# Altium schematic sheet Supply.SchDoc
size A4; SheetNumber: 2; SheetTotal: 10
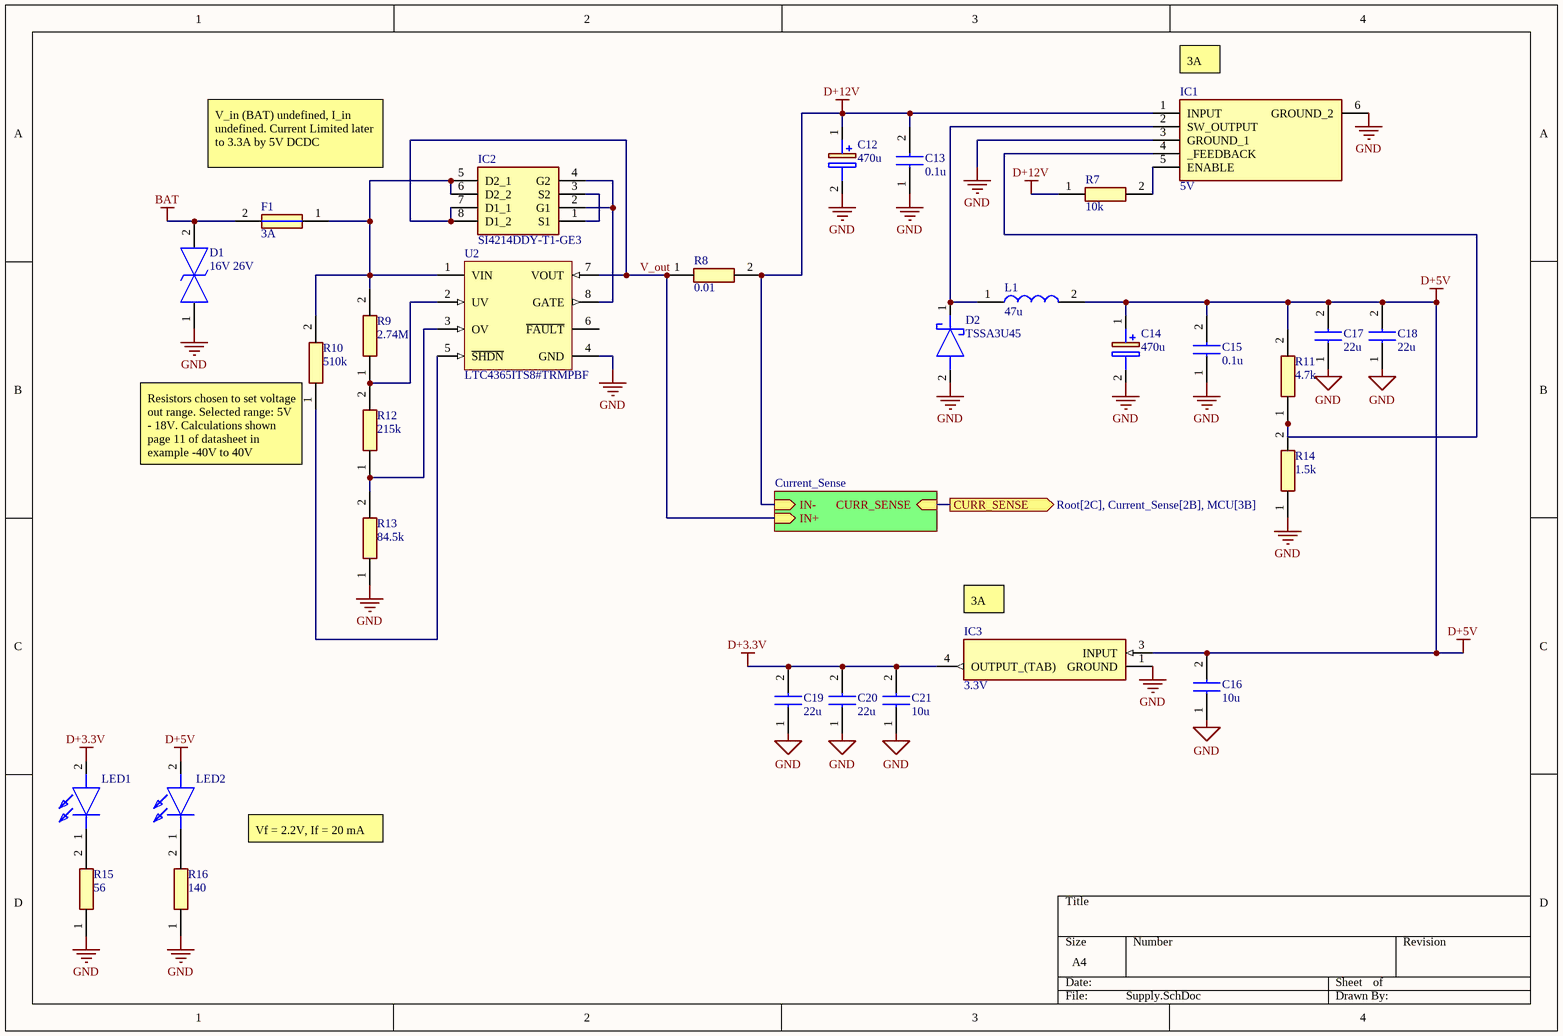
[diagram p0: Supply.SchDoc]

## Parts
C12  470u  [CAPAE1030X1080N]
C13  0.1u  [CAPC1608X90N]
C14  470u  [CAPAE1030X1080N]
C15  0.1u  [CAPC1608X90N]
C16  10u  [GRM18x]
C17  22u  [CAPC2012X95N]
C18  22u  [CAPC2012X95N]
C19  22u  [CAPC2012X95N]
C20  22u  [CAPC2012X95N]
C21  10u  [GRM18x]
D1  16V 26V  [DIONM5226X240N]
D2  TSSA3U45  [DIOM5126X250N]
F1  3A  [FUSC3216X83N]
IC1  5V  [TS2596CM550RNG]
IC2  SI4214DDY-T1-GE3  [SOIC127P600X175-8N]
IC3  3.3V  [TO254P1542X460-3N]
L1  47u  [104CDMCCDS470MC]
LED1  SML-D12P8WT86C  [LEDM1620X150N]  (value not drawn)
LED2  SML-D12P8WT86C  [LEDM1620X150N]  (value not drawn)
R7  10k  [RESC1608X55N]
R8  0.01  [CSS0603FT10L0]
R9  2.74M  [RESC1608X50N]
R10  510k  [RESC1608X55N]
R11  4.7k  [RESC1608X55N]
R12  215k  [RESC1608X55N]
R13  84.5k  [RESC1608X55N]
R14  1.5k  [RESC1608X55N]
R15  56  [RESC2012X60N]
R16  140  [RESC2012X60N]
U2  LTC4365ITS8#TRMPBF  [LT-TS8-8-TSOT-23_V]

## Sub-sheets
Designator = Current_Sense: IN+ (in), IN- (in), CURR_SENSE (in)

## Ports
CURR_SENSE (out, see Root[2C], Current_Sense[2B], MCU[3B])

## Nets
BAT: D1.2 F1.2
D+3.3V: C19.2 C20.2 C21.2 IC3.4(OUTPUT_(TAB)) LED1.2(A)
D+5V: C14.1(+) C15.2 C16.2 C17.2 C18.2 IC3.3(INPUT) L1.2 LED2.2(A) R11.2
D+12V: C12.1(+) C13.2 IC1.1(INPUT) R7.1 R8.2 ; sheet Designator/IN-
GND: C12.2(-) C13.1 C14.2(-) C15.1 C16.1 C17.1 C18.1 C19.1 C20.1 C21.1 D1.1 D2.2(A) IC1.3(GROUND_1) IC1.6(GROUND_2) IC3.1(GROUND) R13.1 R14.1 R15.1 R16.1 U2.4(GND)
CURR_SENSE: port CURR_SENSE, sheet Designator/CURR_SENSE
V_out: IC2.7(D1_1) IC2.8(D1_2) R8.1 U2.7(VOUT) ; sheet Designator/IN+
NetD2_1: D2.1(K) IC1.2(SW_OUTPUT) L1.1
NetF1_1: F1.1 IC2.5(D2_1) IC2.6(D2_2) R9.2 R10.2 U2.1(VIN)
NetIC1_4: IC1.4(_FEEDBACK) R11.1 R14.2
NetIC1_5: IC1.5(ENABLE) R7.2
NetIC2_1: IC2.1(S1) IC2.3(S2)
NetIC2_2: IC2.2(G1) IC2.4(G2) U2.8(GATE)
NetLED1_1: LED1.1(K) R15.2
NetLED2_1: LED2.1(K) R16.2
NetR9_1: R9.1 R12.2 U2.2(UV)
NetR10_1: R10.1 U2.5(~{SHDN})
NetR12_1: R12.1 R13.2 U2.3(OV)

Not connected (* = marked no-connect by the designer): U2 6(~{FAULT})

## Notes on the sheet
- (near IC1) 3A
- V_in (BAT) undefined, I_in undefined. Current Limited later to 3.3A by 5V DCDC
- (near R10) Resistors chosen to set voltage out range. Selected range: 5V - 18V. Calculations shown page 11 of datasheet in example -40V to 40V
- (near IC3) 3A
- Vf = 2.2V, If = 20 mA

## Library data of the parts
C12 C14 = UWT1E471MNL1GS: Manufacturer_Name: Nichicon; Datasheet Link: http://www.nichicon.co.jp/english/products/pdfs/e-uwt.pdf; Height: 10.8mm; Manufacturer_Part_Number: UWT1E471MNL1GS; Mouser Part Number: 647-UWT1E471MNL1S; Mouser Price/Stock: https://www.mouser.co.uk/ProductDetail/Nichicon/UWT1E471MNL1GS?qs=58AOoXU9eaxhCCrDm%2FRamg%3D%3D; Arrow Part Number: UWT1E471MNL1GS; Arrow Price/Stock: https://www.arrow.com/en/products/uwt1e471mnl1gs/nichicon?region=nac
C13 C15 = CC0603KRX7R8BB104: Manufacturer_Name: KEMET; Datasheet Link: https://datasheet.datasheetarchive.com/originals/distributors/Datasheets_SAMA/d9f127a4875522309d99aa7dec79633c.pdf; Height: 0.9mm; Manufacturer_Part_Number: CC0603KRX7R8BB104; Mouser Part Number: 603-CC603KRX7R8BB104; Mouser Price/Stock: https://www.mouser.co.uk/ProductDetail/Yageo/CC0603KRX7R8BB104?qs=AgBp2OyFlx%252B4QOgEm%2Fb3YQ%3D%3D; Arrow Part Number: CC0603KRX7R8BB104; Arrow Price/Stock: https://www.arrow.com/en/products/cc0603krx7r8bb104/yageo
C16 C21 = GRM188R61A106ME69D: Manufacturer_Name: Murata Electronics; Datasheet Link: https://search.murata.co.jp/Ceramy/image/img/A01X/G101/ENG/GRM188R61A106ME69-01A.pdf; Height: 0.8mm; Manufacturer_Part_Number: GRM188R61A106ME69D; Mouser Part Number: 81-GRM188R61A106ME9D; Mouser Price/Stock: https://www.mouser.co.uk/ProductDetail/Murata-Electronics/GRM188R61A106ME69D?qs=o98hbGm2QKGN31NsNZp5HQ%3D%3D; Arrow Part Number: GRM188R61A106ME69D; Arrow Price/Stock: https://www.arrow.com/en/products/grm188r61a106me69d/murata-manufacturing?region=nac
C17-C20 = GRM219R61A226MEA0D: Manufacturer_Name: Murata Electronics; Datasheet Link: http://www.murata.com/~/media/webrenewal/support/library/catalog/products/capacitor/mlcc/c02e.pdf; Height: 0.95mm; Manufacturer_Part_Number: GRM219R61A226MEA0D; Mouser Part Number: 81-GRM219R61A226ME0D; Mouser Price/Stock: https://www.mouser.co.uk/ProductDetail/Murata-Electronics/GRM219R61A226MEA0D?qs=eeBpzGFlv%252B9ilUnm7iaG2w%3D%3D; Arrow Part Number: GRM219R61A226MEA0D; Arrow Price/Stock: https://www.arrow.com/en/products/grm219r61a226mea0d/murata-manufacturing?region=nac
D1 = SMAJ16CA-13-F: Manufacturer_Name: Diodes Incorporated; Datasheet Link: https://www.diodes.com/assets/Datasheets/ds19005.pdf; Height: 2.4mm; Manufacturer_Part_Number: SMAJ16CA-13-F; Mouser Part Number: 621-SMAJ16CA-13-F; Mouser Price/Stock: https://www.mouser.co.uk/ProductDetail/Diodes-Incorporated/SMAJ16CA-13-F?qs=sxN%252BoM2fis%252Bu4iX3J5Cr7g%3D%3D; Arrow Part Number: SMAJ16CA-13-F; Arrow Price/Stock: https://www.arrow.com/en/products/smaj16ca-13-f/diodes-incorporated?region=nac
D2 = TSSA3U45: Schottky Diode; Manufacturer_Name: Taiwan Semiconductor; Height: 2.5mm; Manufacturer_Part_Number: TSSA3U45; Mouser Part Number: 821-TSSA3U45; Mouser Price/Stock: https://www.mouser.co.uk/ProductDetail/Taiwan-Semiconductor/TSSA3U45?qs=9cRNMfhK%252BrST5ZgV9DORjA%3D%3D
F1 = 0685T3000-01: Manufacturer_Name: BelFuse; Datasheet Link: https://www.belfuse.com/resources/datasheets/circuitprotection/ds-cp-c1t-series.pdf; Height: 0.83mm; Manufacturer_Part_Number: 0685T3000-01; Arrow Part Number: 0685T3000-01; Arrow Price/Stock: https://www.arrow.com/en/products/0685t3000-01/bel-group
IC1 = TS2596CM550_RNG: Manufacturer_Name: Taiwan Semiconductor; Manufacturer_Part_Number: TS2596CM550 RNG; Datasheet Link: https://www.taiwansemi.com/products/datasheet/TS2596_G1608.pdf; Height: 4.85mm; Mouser Part Number: 821-TS2596CM550RNG; Mouser Price/Stock: https://www.mouser.co.uk/ProductDetail/Taiwan-Semiconductor/TS2596CM550-RNG?qs=QEzMiVqgwc1IpOivVc2Ydw%3D%3D; Arrow Part Number: TS2596CM550 RNG; Arrow Price/Stock: https://www.arrow.com/en/products/ts2596cm550rng/taiwan-semiconductor?region=europe
IC2 = SI4214DDY-T1-GE3: Integrated Circuit; Manufacturer_Name: Vishay; Datasheet Link: https://www.vishay.com/docs/65022/si4214ddy.pdf; Height: 1.75mm; Manufacturer_Part_Number: SI4214DDY-T1-GE3; Mouser Part Number: 781-SI4214DDY-GE3; Mouser Price/Stock: https://www.mouser.co.uk/ProductDetail/Vishay-Semiconductors/SI4214DDY-T1-GE3?qs=kt16UJ73eEGZKWuc2RKrng%3D%3D; Arrow Part Number: SI4214DDY-T1-GE3; Arrow Price/Stock: https://www.arrow.com/en/products/si4214ddy-t1-ge3/vishay
IC3 = LD1085D2M33R: Manufacturer_Name: STMicroelectronics; Datasheet Link: http://www.st.com/web/en/resource/technical/document/datasheet/CD00001883.pdf; Height: 4.6mm; Manufacturer_Part_Number: LD1085D2M33R; Mouser Part Number: 511-LD1085D2M33-TR; Mouser Price/Stock: https://www.mouser.co.uk/ProductDetail/STMicroelectronics/LD1085D2M33R?qs=LWigd6wg%252B9coO4fwnjoeQg%3D%3D; Arrow Part Number: LD1085D2M33R; Arrow Price/Stock: https://www.arrow.com/en/products/ld1085d2m33r/stmicroelectronics?region=nac
L1 = 104CDMCCDS-470MC: Manufacturer_Name: Sumida; Datasheet Link: https://products.sumida.com/products/pdf/104CDMCCDS.pdf; Height: 4mm; Manufacturer_Part_Number: 104CDMCCDS-470MC; Mouser Part Number: 851-104CDMCCDS-470MC; Mouser Price/Stock: https://www.mouser.co.uk/ProductDetail/Sumida/104CDMCCDS-470MC?qs=D3efs7kfDkXJMDQiS36zsw%3D%3D; Arrow Part Number: 104CDMCCDS-470MC; Arrow Price/Stock: https://www.arrow.com/en/products/104cdmccds-470mc/sumida?region=nac
LED1 LED2 = SML-D12P8WT86C: LED; Manufacturer_Name: ROHM Semiconductor; Datasheet Link: https://datasheet.datasheetarchive.com/originals/distributors/DKDS-39/8731.pdf; Height: 1.5mm; Manufacturer_Part_Number: SML-D12P8WT86C; Mouser Part Number: 755-SML-D12P8WT86C; Mouser Price/Stock: https://www.mouser.co.uk/ProductDetail/ROHM-Semiconductor/SML-D12P8WT86C?qs=HXFqYaX1Q2wFepzn1zWRrg%3D%3D
R7 = RC0603FR0710KL: Manufacturer_Name: KEMET; Datasheet Link: http://www.yageo.com/documents/recent/PYu-RC0603_51_RoHS_L_v5.pdf; Height: 0.55mm; Manufacturer_Part_Number: RC0603FR0710KL; Arrow Part Number: RC0603FR0710KL; Arrow Price/Stock: https://www.arrow.com/en/products/rc0603fr-0710kl/yageo
R8 = CSS0603FT10L0: Manufacturer_Name: Stackpole Electronics; Datasheet Link: https://cs.seielect.com/catalog/SEI-CSS_CSSH.PDF; Height: 0.65mm; Manufacturer_Part_Number: CSS0603FT10L0; Mouser Part Number: 708-CSS0603FT10L0; Mouser Price/Stock: https://www.mouser.co.uk/ProductDetail/SEI-Stackpole/CSS0603FT10L0?qs=IPgv5n7u5QYzRPLHp2eb2A%3D%3D
R9 = CRCW06032M74FKEA: Manufacturer_Name: Vishay; Datasheet Link: http://www.vishay.com/docs/20035/dcrcwe3.pdf; Height: 0.5mm; Manufacturer_Part_Number: CRCW06032M74FKEA; Mouser Part Number: 71-CRCW0603-2.74M-E3; Mouser Price/Stock: https://www.mouser.co.uk/ProductDetail/Vishay-Dale/CRCW06032M74FKEA?qs=m78yHlr47QCVMroNQkprhA%3D%3D
R10 = RC0603JR-07510KL: Manufacturer_Name: YAGEO; Datasheet Link: https://www.yageo.com/upload/media/product/productsearch/datasheet/rchip/PYu-RC_Group_51_RoHS_L_12.pdf; Height: 0.55mm; Manufacturer_Part_Number: RC0603JR-07510KL; Mouser Part Number: 603-RC0603JR-07510KL; Mouser Price/Stock: https://www.mouser.co.uk/ProductDetail/YAGEO/RC0603JR-07510KL?qs=KptU%252BSbrlu3yTjO7DJSdzQ%3D%3D; Arrow Part Number: RC0603JR-07510KL; Arrow Price/Stock: https://www.arrow.com/en/products/rc0603jr-07510kl/yageo?region=nac
R11 = RC0603FR-074K7L: Manufacturer_Name: YAGEO; Datasheet Link: https://componentsearchengine.com/Datasheets/2/RC0603FR-074K7L.pdf; Height: 0.55mm; Manufacturer_Part_Number: RC0603FR-074K7L; Mouser Part Number: 603-RC0603FR-074K7L; Mouser Price/Stock: https://www.mouser.co.uk/ProductDetail/YAGEO/RC0603FR-074K7L?qs=gt6vzsuosg37y0l7Vt36bQ%3D%3D; Arrow Part Number: RC0603FR-074K7L; Arrow Price/Stock: https://www.arrow.com/en/products/rc0603fr-074k7l/yageo?region=nac
R12 = ERJ-3EKF2153V: Manufacturer_Name: Panasonic; Datasheet Link: http://industrial.panasonic.com/cdbs/www-data/pdf/RDA0000/AOA0000C86.pdf; Height: 0.55mm; Manufacturer_Part_Number: ERJ-3EKF2153V; Mouser Part Number: 667-ERJ-3EKF2153V; Mouser Price/Stock: https://www.mouser.com/Search/Refine.aspx?Keyword=667-ERJ-3EKF2153V; Arrow Part Number: ERJ-3EKF2153V; Arrow Price/Stock: https://www.arrow.com/en/products/erj-3ekf2153v/panasonic
R13 = RC0603FR-0784K5L: Manufacturer_Name: KEMET; Datasheet Link: http://www.yageo.com/documents/recent/PYu-RC0603_51_RoHS_L_v5.pdf; Height: 0.55mm; Manufacturer_Part_Number: RC0603FR-0784K5L; Mouser Part Number: 603-RC0603FR-0784K5L; Mouser Price/Stock: https://www.mouser.com/Search/Refine.aspx?Keyword=603-RC0603FR-0784K5L; Arrow Part Number: RC0603FR-0784K5L; Arrow Price/Stock: https://www.arrow.com/en/products/rc0603fr-0784k5l/yageo
R14 = RC0603FR-071K5L: Manufacturer_Name: KEMET; Datasheet Link: http://www.yageo.com/documents/recent/PYu-RC0603_51_RoHS_L_v5.pdf; Height: 0.55mm; Manufacturer_Part_Number: RC0603FR-071K5L; Mouser Part Number: 603-RC0603FR-071K5L; Mouser Price/Stock: https://www.mouser.co.uk/ProductDetail/YAGEO/RC0603FR-071K5L?qs=VU8sRB4EgwBMt9nc4XGNgA%3D%3D; Arrow Part Number: RC0603FR-071K5L; Arrow Price/Stock: https://www.arrow.com/en/products/rc0603fr-071k5l/yageo?region=nac
R15 = RC0805FR-0756RL: Manufacturer_Name: KEMET; Datasheet Link: http://www.yageo.com/documents/recent/PYu-RC_Group_51_RoHS_L_10.pdf; Height: 0.6mm; Manufacturer_Part_Number: RC0805FR-0756RL; Mouser Part Number: 603-RC0805FR-0756RL; Mouser Price/Stock: https://www.mouser.co.uk/ProductDetail/YAGEO/RC0805FR-0756RL?qs=VLOqbHBAO5ckb16qgp9IuA%3D%3D; Arrow Part Number: RC0805FR-0756RL; Arrow Price/Stock: https://www.arrow.com/en/products/rc0805fr-0756rl/yageo?region=nac
R16 = RC0805FR-07140RL: Manufacturer_Name: KEMET; Datasheet Link: http://www.yageo.com/documents/recent/PYu-RC_Group_51_RoHS_L_10.pdf; Height: 0.6mm; Manufacturer_Part_Number: RC0805FR-07140RL; Mouser Part Number: 603-RC0805FR-07140RL; Mouser Price/Stock: https://www.mouser.co.uk/ProductDetail/YAGEO/RC0805FR-07140RL?qs=8Y8p%252BasKcI7sqDTj5iJQmA%3D%3D; Arrow Part Number: RC0805FR-07140RL; Arrow Price/Stock: https://www.arrow.com/en/products/rc0805fr-07140rl/yageo?region=nac
U2 = CMP-0474-00861-1: UV, OV and Reverse Supply Protection Controller, 2.5 to 34 V Vin, 8-pin SOT23 (TS8-8), -40 to 85 degC, Pb-Free, Mini Tape and Reel; Manufacturer: Linear Technology; Fault: yes; Fast Comparator: no; Extended Temp: C, I, H; Circuit Breakers(#): 1; RoHS: TRUE; ComponentLink2URL: http://cds.linear.com/docs/en/datasheet/4365f.pdf; PartNumber: LTC4365ITS8#TRMPBF; ComponentLink3Description: Package Specification; Power Good: no; Packing: Mini Tape and Reel; ComponentLink2Description: Datasheet; Vin Range: 2.5 to 34 V; Active Limiting: no; Foldback: no; Reset: no; ComponentLink3URL: http://cds.linear.com/docs/en/packaging/SOT_8_05-08-1637.pdf; PackageVersion: Rev. A, 08/2010; Code_JEDEC: MO-193; ComponentLink1Description: Manufacturer URL; Mounting Technology: Surface Mount; ComponentLink1URL: http://www.linear.com/; PackageDescription: 8-Pin Plastic TSOT-23, Body 2.9 x 1.63 mm, Pitch 0.65 mm; PackageReference: TS8-8